# EAGLE design ads1115_feather_4chan (EAGLE 9.1.0)
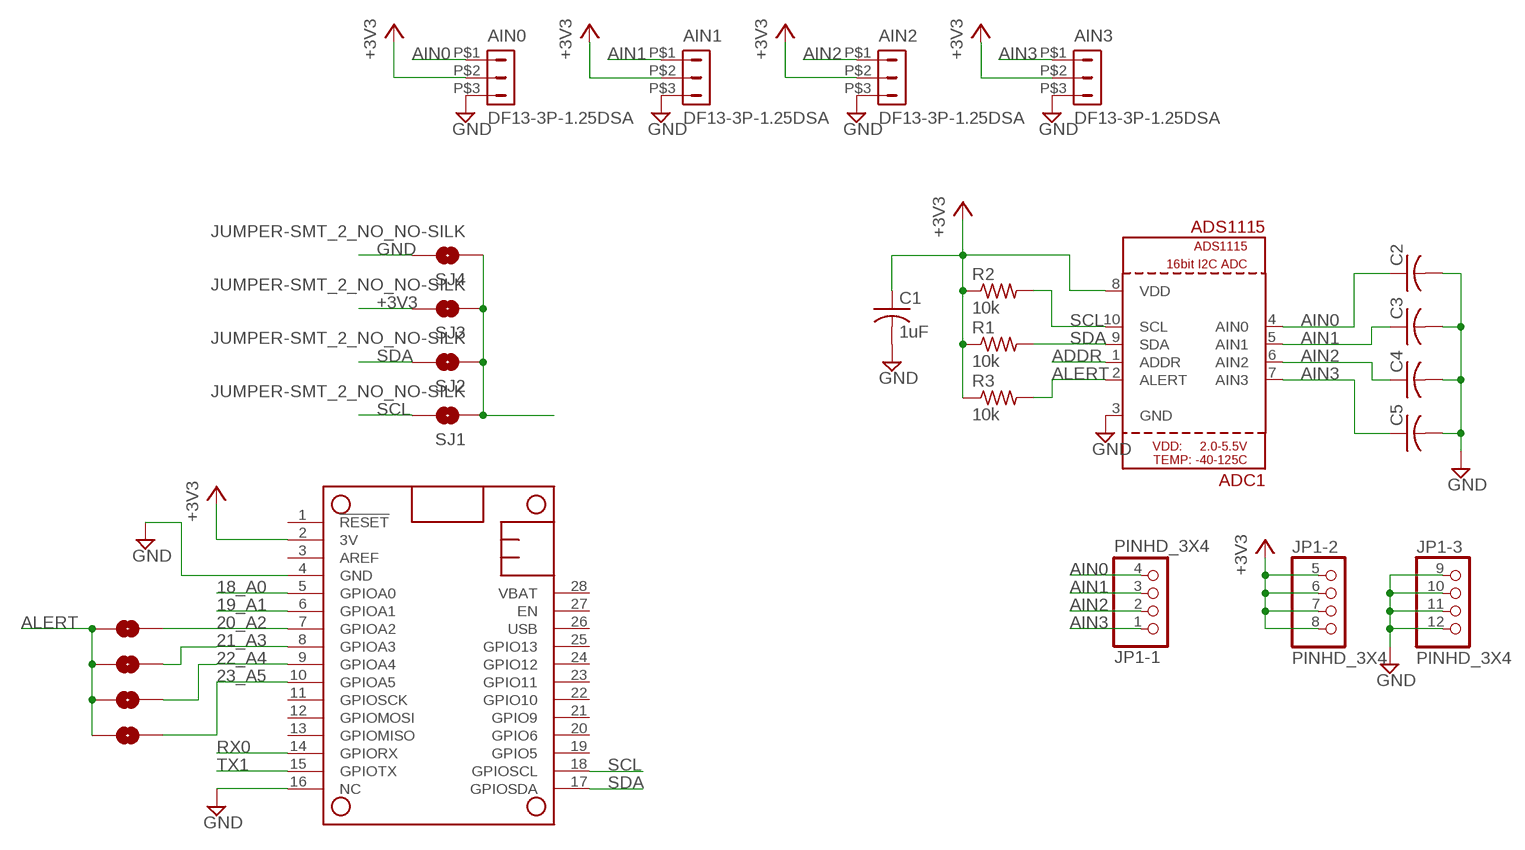
[diagram p0: schematic, sheet 1]

## Parts
ADC1  ADS1115  [MSOP10]
AIN0  DF13-3P-1.25DSA  [DF13-3P-1.25DSA]
AIN1  DF13-3P-1.25DSA  [DF13-3P-1.25DSA]
AIN2  DF13-3P-1.25DSA  [DF13-3P-1.25DSA]
AIN3  DF13-3P-1.25DSA  [DF13-3P-1.25DSA]
C1  1uF  C-USC0805K  [C0805K]
C2  C-USC0805K  [C0805K]
C3  C-USC0805K  [C0805K]
C4  C-USC0805K  [C0805K]
C5  C-USC0805K  [C0805K]
JP1  PINHD_3X4  [3X4]
MS1  FEATHERWING  [FEATHERWING]
R1  10k  R-US_R0805  [R0805]
R2  10k  R-US_R0805  [R0805]
R3  10k  R-US_R0805  [R0805]
SJ1  JUMPER-SMT_2_NO_NO-SILK  [SMT-JUMPER_2_NO_NO-SILK]
SJ2  JUMPER-SMT_2_NO_NO-SILK  [SMT-JUMPER_2_NO_NO-SILK]
SJ3  JUMPER-SMT_2_NO_NO-SILK  [SMT-JUMPER_2_NO_NO-SILK]
SJ4  JUMPER-SMT_2_NO_NO-SILK  [SMT-JUMPER_2_NO_NO-SILK]
SJ5  JUMPER-SMT_2_NO_NO-SILK  [SMT-JUMPER_2_NO_NO-SILK]
SJ6  JUMPER-SMT_2_NO_NO-SILK  [SMT-JUMPER_2_NO_NO-SILK]
SJ7  JUMPER-SMT_2_NO_NO-SILK  [SMT-JUMPER_2_NO_NO-SILK]
SJ8  JUMPER-SMT_2_NO_NO-SILK  [SMT-JUMPER_2_NO_NO-SILK]

## Nets
18_A0: MS1.5(GPIOA0)
19_A1: MS1.6(GPIOA1)
20_A2: MS1.7(GPIOA2) SJ7.2
21_A3: MS1.8(GPIOA3) SJ6.2
22_A4: MS1.9(GPIOA4) SJ5.2
23_A5: MS1.10(GPIOA5) SJ8.2
+3V3: ADC1.8(VDD) AIN0.P$2 AIN1.P$2 AIN2.P$2 AIN3.P$2 C1.1 JP1.5 JP1.6 JP1.7 JP1.8 MS1.2(3V) R1.1 R2.1 R3.1 SJ3.2
ADDR: ADC1.1(ADDR) SJ1.1 SJ2.1 SJ3.1 SJ4.1
AIN0: ADC1.4(AIN0) AIN0.P$1 C2.1 JP1.4
AIN1: ADC1.5(AIN1) AIN1.P$1 C3.1 JP1.3
AIN2: ADC1.6(AIN2) AIN2.P$1 C4.1 JP1.2
AIN3: ADC1.7(AIN3) AIN3.P$1 C5.1 JP1.1
ALERT: ADC1.2(ALERT) R3.2 SJ5.1 SJ6.1 SJ7.1 SJ8.1
GND: ADC1.3(GND) AIN0.P$3 AIN1.P$3 AIN2.P$3 AIN3.P$3 C1.2 C2.2 C3.2 C4.2 C5.2 JP1.9 JP1.10 JP1.11 JP1.12 MS1.4(GND) MS1.16(NC) SJ4.2
RX0: MS1.14(GPIORX)
SCL: ADC1.10(SCL) MS1.18(GPIOSCL) R2.2 SJ1.2
SDA: ADC1.9(SDA) MS1.17(GPIOSDA) R1.2 SJ2.2
TX1: MS1.15(GPIOTX)
Unconnected: MS1.1(!RESET) MS1.3(AREF) MS1.11(GPIOSCK) MS1.12(GPIOMOSI) MS1.13(GPIOMISO) MS1.19(GPIO5) MS1.20(GPIO6) MS1.21(GPIO9) MS1.22(GPIO10) MS1.23(GPIO11) MS1.24(GPIO12) MS1.25(GPIO13) MS1.26(USB) MS1.27(EN) MS1.28(VBAT)

## Library data of the parts
ADC1 = vtgs:ADS1115
AIN0 AIN1-AIN3 = con-hirose-df13:DF13-3P-1.25: DF13-3P 1.25mm Pitch Miniature Crimping Connector.
C1-C5 = rcl:C-US: CAPACITOR, American symbol; SPICEPREFIX: C
JP1 = kj4qlp:PINHD_3X4
MS1 = adafruit:FEATHERWING
R1-R3 = rcl:R-US_: RESISTOR, American symbol; SPICEPREFIX: R
SJ1-SJ8 = SparkFun-Jumpers:JUMPER-SMT_2_NO: Normally open jumper This jumper has two pads in close proximity to each other. Apply solder to close the connection. Round pads are easier to solder for beginners, but are a lot larger. SparkFun Product that uses the round pads: SparkFun EL Sequencer <https://www.sparkfun.com/products/12781>

## Board
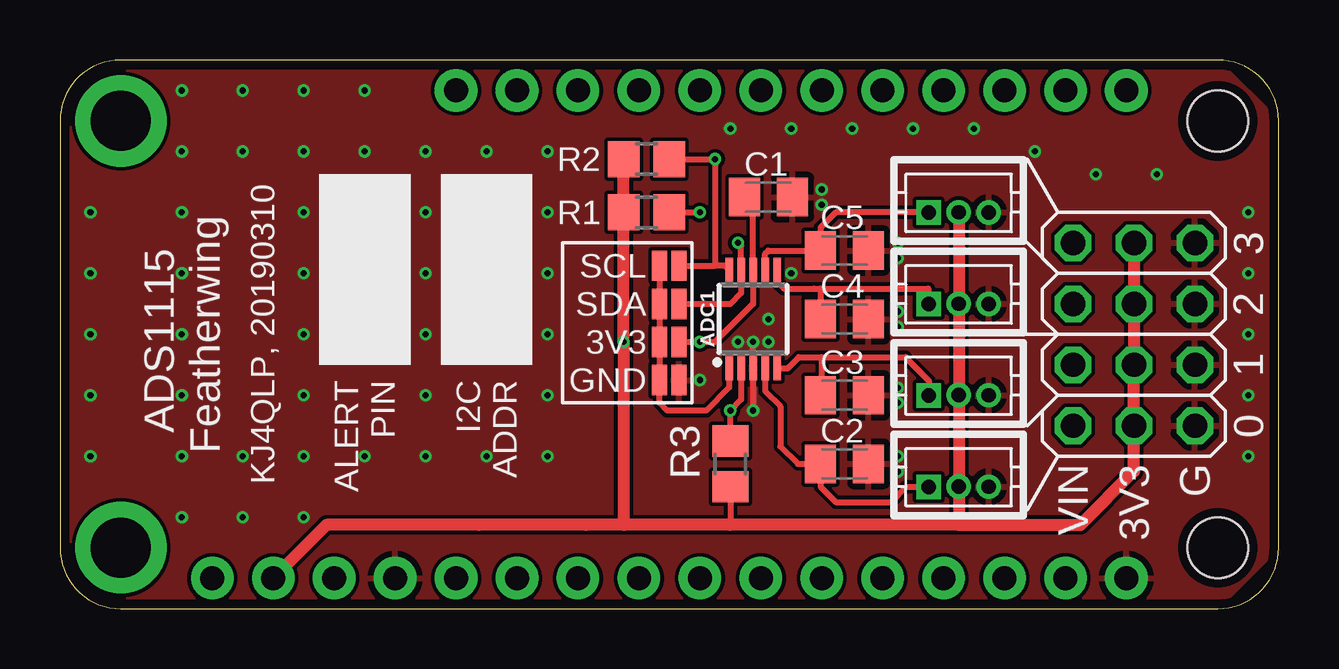
[diagram p1: board, top side]
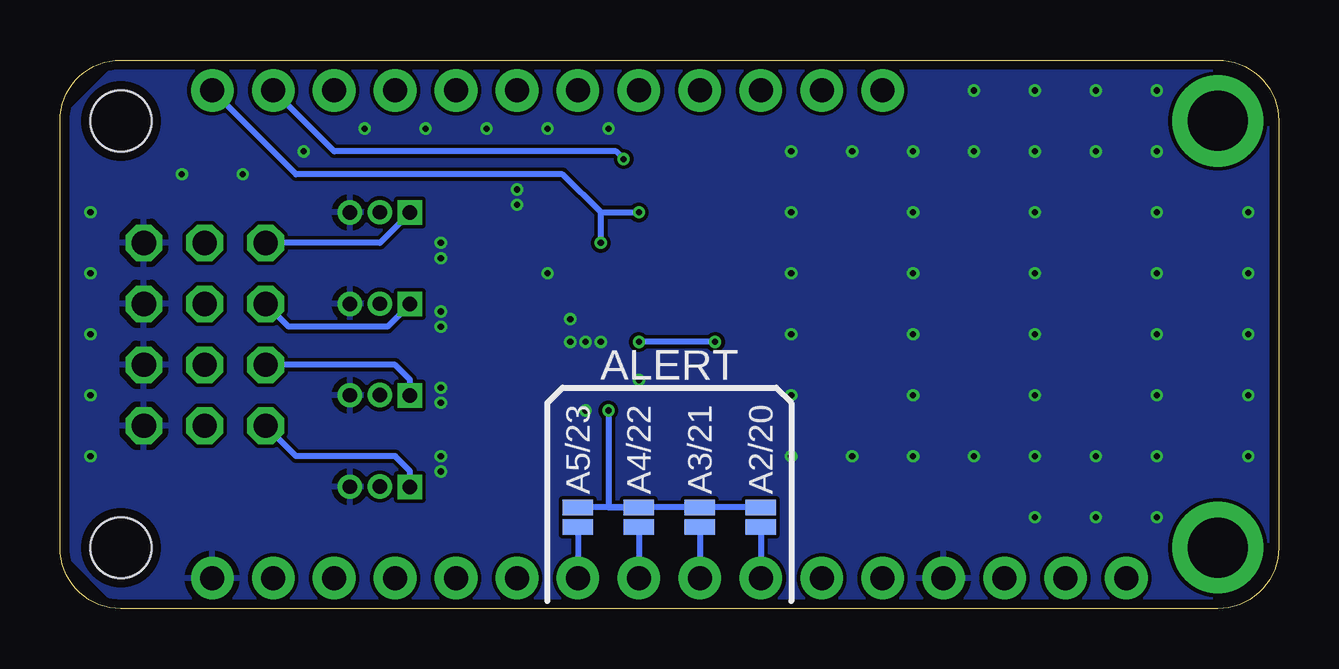
[diagram p2: board, bottom side, seen from below]

Size 50.8 x 22.86 mm. Coordinates in mm from the lower left corner, seen from the top.
Copper layers (1*16): Top 0.035559375mm / dielectric 1.6mm / Bottom 0.035559375mm
Design rules "oshpark-2layer *": minimum track width 6mil, minimum drill 10mil, track to track 6mil, track to pad 6mil, pad to pad 6mil, via to via 6mil, smd to smd 6mil, copper to edge 15mil, drill to drill 6mil, minimum pad ring 5mil, minimum via ring 5mil, stop-mask expansion 2.5mil, vias tented up to drill 10mil, thermal gap 10mil

### Footprints (pad centres in the part's own frame; a part is rotated, then mirrored left to right if it is on the bottom)
MSOP10 = smd 0.3 x 1: 1 -1,-2.05; 2 -0.5,-2.05; 3 0,-2.05; 4 0.5,-2.05; 5 1,-2.05; 6 1,2.05; 7 0.5,2.05; 8 0,2.05; 9 -0.5,2.05; 10 -1,2.05
DF13-3P-1.25DSA = drill 0.6 pad 1.016 square: P$1 1.25,0.005 | drill 0.6 pad 1.016: P$2 0,-0.005; P$3 -1.25,0
C0805K = smd 1.3 x 1.6: 1 -1,0; 2 1,0
3X4 = drill 1.016 octagon: 1 -3.81,-1.27; 2 -1.27,-1.27; 3 1.27,-1.27; 4 3.81,-1.27; 5 -3.81,1.27; 6 -1.27,1.27; 7 1.27,1.27; 8 3.81,1.27; 9 -3.81,3.81; 10 -1.27,3.81; 11 1.27,3.81; 12 3.81,3.81
FEATHERWING = drill 1 pad 1.778: 1 6.35,1.27; 2 8.89,1.27; 3 11.43,1.27; 4 13.97,1.27; 5 16.51,1.27; 6 19.05,1.27; 7 21.59,1.27; 8 24.13,1.27; 9 26.67,1.27; 10 29.21,1.27; 11 31.75,1.27; 12 34.29,1.27; 13 36.83,1.27; 14 39.37,1.27; 15 41.91,1.27; 16 44.45,1.27; 17 44.45,21.59; 18 41.91,21.59; 19 39.37,21.59; 20 36.83,21.59; 21 34.29,21.59; 22 31.75,21.59; 23 29.21,21.59; 24 26.67,21.59; 25 24.13,21.59; 26 21.59,21.59; 27 19.05,21.59; 28 16.51,21.59 | drill 2.5 pad 3.81: P$1 2.54,20.32; P$2 2.54,2.54 | hole 2.54: 48.26,20.32; 48.26,2.54
R0805 = smd 1.3 x 1.5: 1 -0.95,0; 2 0.95,0
SMT-JUMPER_2_NO_NO-SILK = smd 0.635 x 1.27: 1 -0.406,0; 2 0.406,0

### Placement (x,y rotation side)
ADC1  28.89,12.06 0 top
AIN0  37.47,5.08 180 top
AIN1  37.47,8.89 180 top
AIN2  37.47,12.7 180 top
AIN3  37.47,16.51 180 top
C1  29.53,17.14 0 top
C2  32.7,6.03 0 top
C3  32.7,8.89 0 top
C4  32.7,12.06 0 top
C5  32.7,14.92 0 top
JP1  43.5,11.43 270 top
MS1  0,0 0 top
R1  24.45,16.51 0 top
R2  24.45,18.73 0 top
R3  27.94,6.03 90 top
SJ1  25.4,14.29 0 top
SJ2  25.4,12.7 0 top
SJ3  25.4,11.11 0 top
SJ4  25.4,9.53 0 top
SJ5  26.67,3.81 270 bottom
SJ6  24.13,3.81 270 bottom
SJ7  21.59,3.81 270 bottom
SJ8  29.21,3.81 270 bottom

### Tracks (layer width: path | path; a pad name or v marks a point on that pad's centre or on a via)
20_A2
  Bottom 0.254: SJ7.2 MS1.7
21_A3
  Bottom 0.254: SJ6.2 MS1.8
22_A4
  Bottom 0.254: SJ5.2 MS1.9
23_A5
  Bottom 0.254: SJ8.2 MS1.10
+3V3  (via drill 0.25)
  Top 0.254: C1.1 28.89,16.78 ADC1.8 28.89,12.7 27.3,11.11 v26.67,11.11 SJ3.2 | R3.1 27.94,3.49
  Top 0.508: AIN3.P$2 AIN2.P$2 37.47,11.43 37.47,11.11 AIN1.P$2 AIN0.P$2 37.47,3.49 | MS1.2 11.11,3.49 17.46,3.49 21.91,3.49 23.5,3.49 | 37.47,3.49 42.55,3.49 44.77,5.71 JP1.8 JP1.7 JP1.6 JP1.5 | R1.1 R2.1 | R1.1 | R1.1 v23.5,11.11 23.5,3.49 | 37.47,3.49 27.94,3.49 23.5,3.49
  Bottom 0.254: v23.5,11.11 v26.67,11.11
ADDR
  Top 0.254: SJ1.1 SJ2.1 SJ3.1 SJ4.1 24.99,8.57 25.31,8.26 26.94,8.26 27.89,9.21 ADC1.1
AIN0
  Top 0.254: AIN0.P$1 35.26,5.08 34.63,4.44 32.34,4.44 31.7,5.08 C2.1 30.75,6.03 30.03,6.75 30.03,8.43 29.39,9.06 ADC1.4
  Bottom 0.254: AIN0.P$1 36.22,5.74 36.83,6.35 40.96,6.35 JP1.4
AIN1
  Top 0.254: ADC1.5 30.34,10.02 30.8,10.48 31.75,10.48 | 31.75,10.48 35.24,10.48 36.22,9.51 AIN1.P$1 | 31.75,10.48 31.75,10.16 31.75,8.94 C3.1
  Bottom 0.254: AIN1.P$1 36.22,9.54 36.83,10.16 JP1.3
AIN2
  Top 0.254: ADC1.6 29.89,13.61 30.17,13.33 31.43,13.33 31.7,13.33 | AIN2.P$1 36.2,12.7 36.2,13.33 31.7,13.33 | 31.7,13.33 C4.1
  Bottom 0.254: AIN2.P$1 37.15,11.75 41.27,11.75 JP1.2
AIN3
  Top 0.254: ADC1.7 29.39,14.79 29.53,14.92 31.39,14.92 C5.1 31.7,15.88 32.34,16.51 33.29,16.51 AIN3.P$1
  Bottom 0.254: AIN3.P$1 36.22,16.49 37.47,15.24 JP1.1
ALERT  (via drill 0.25)
  Top 0.254: ADC1.2 28.39,8.71 v27.94,8.26 R3.2
  Bottom 0.254: SJ7.1 SJ6.1 SJ5.1 | SJ5.1 SJ8.1 | v27.94,8.26 27.94,4.22 SJ5.1
GND  (via drill 0.25)
  Top 0.254: v28.89,8.26 ADC1.3 v28.89,11.11
  other vias: 5.08,21.59 34.92,12.38 34.92,9.21 34.92,5.71 34.92,15.24 31.75,17.46 29.53,11.11 31.75,16.83 34.92,14.61 34.92,11.75 34.92,8.57 34.92,6.35 26.67,9.53 30.48,13.97 29.53,12.06 28.26,11.11 7.62,21.59 10.16,21.59 12.7,21.59 1.27,11.43 1.27,13.97 1.27,16.51 1.27,6.35 7.62,19.05 10.16,16.51 10.16,13.97 10.16,11.43 10.16,8.89 10.16,3.81 7.62,3.81 12.7,19.05 15.24,16.51 15.24,13.97 15.24,11.43 15.24,8.89 12.7,6.35 15.24,19.05 17.78,19.05 20.32,16.51 20.32,13.97 20.32,11.43 20.32,8.89 20.32,6.35 45.72,18.1 43.18,18.1 20.32,19.05 1.27,8.89 49.53,16.51 49.53,11.43 49.53,13.97 49.53,8.89 49.53,6.35 33.02,20 27.94,20 38.1,20 30.48,20 35.56,20 10.16,19.05 10.16,6.35 15.24,6.35 5.08,3.81 40.64,19.05 17.78,6.35 5.08,6.35 5.08,8.89 5.08,11.43 5.08,13.97 5.08,16.51 5.08,19.05 7.62,6.35
  pour Bottom: 0,2.54 0,20.32 2.54,22.86 48.26,22.86 50.8,20.32 50.8,2.54 48.26,0 2.54,0
  pour Top: 0,2.54 0,20.32 2.54,22.86 48.26,22.86 50.8,20.32 50.8,2.54 48.26,0 2.54,0
SCL  (via drill 0.25)
  Top 0.254: R2.2 v27.3,18.73 27.3,14.29 | ADC1.10 27.72,14.29 27.3,14.29 | SJ1.2 27.3,14.29
  Bottom 0.254: MS1.18 39.37,19.05 27.62,19.05 v27.3,18.73
SDA  (via drill 0.25)
  Top 0.254: v28.26,15.24 28.39,15.11 ADC1.9 28.39,13.15 27.94,12.7 SJ2.2 | R1.2 v26.67,16.51
  Bottom 0.254: MS1.17 40.96,18.1 29.84,18.1 28.26,16.51 | 28.26,16.51 v26.67,16.51 | v28.26,15.24 28.26,16.51

### Text on the board
tPlace: 3 | SCL | SDA | 2 | ADS1115 / Featherwing | KJ4QLP, 20190310 | 3V3 | ALERT / PIN | I2C / ADDR | GND | 1 | 0 | VIN | 3V3 | G
bPlace: ALERT | A2/20 | A3/21 | A4/22 | A5/23